# EAGLE design kick_test (EAGLE 4.16)
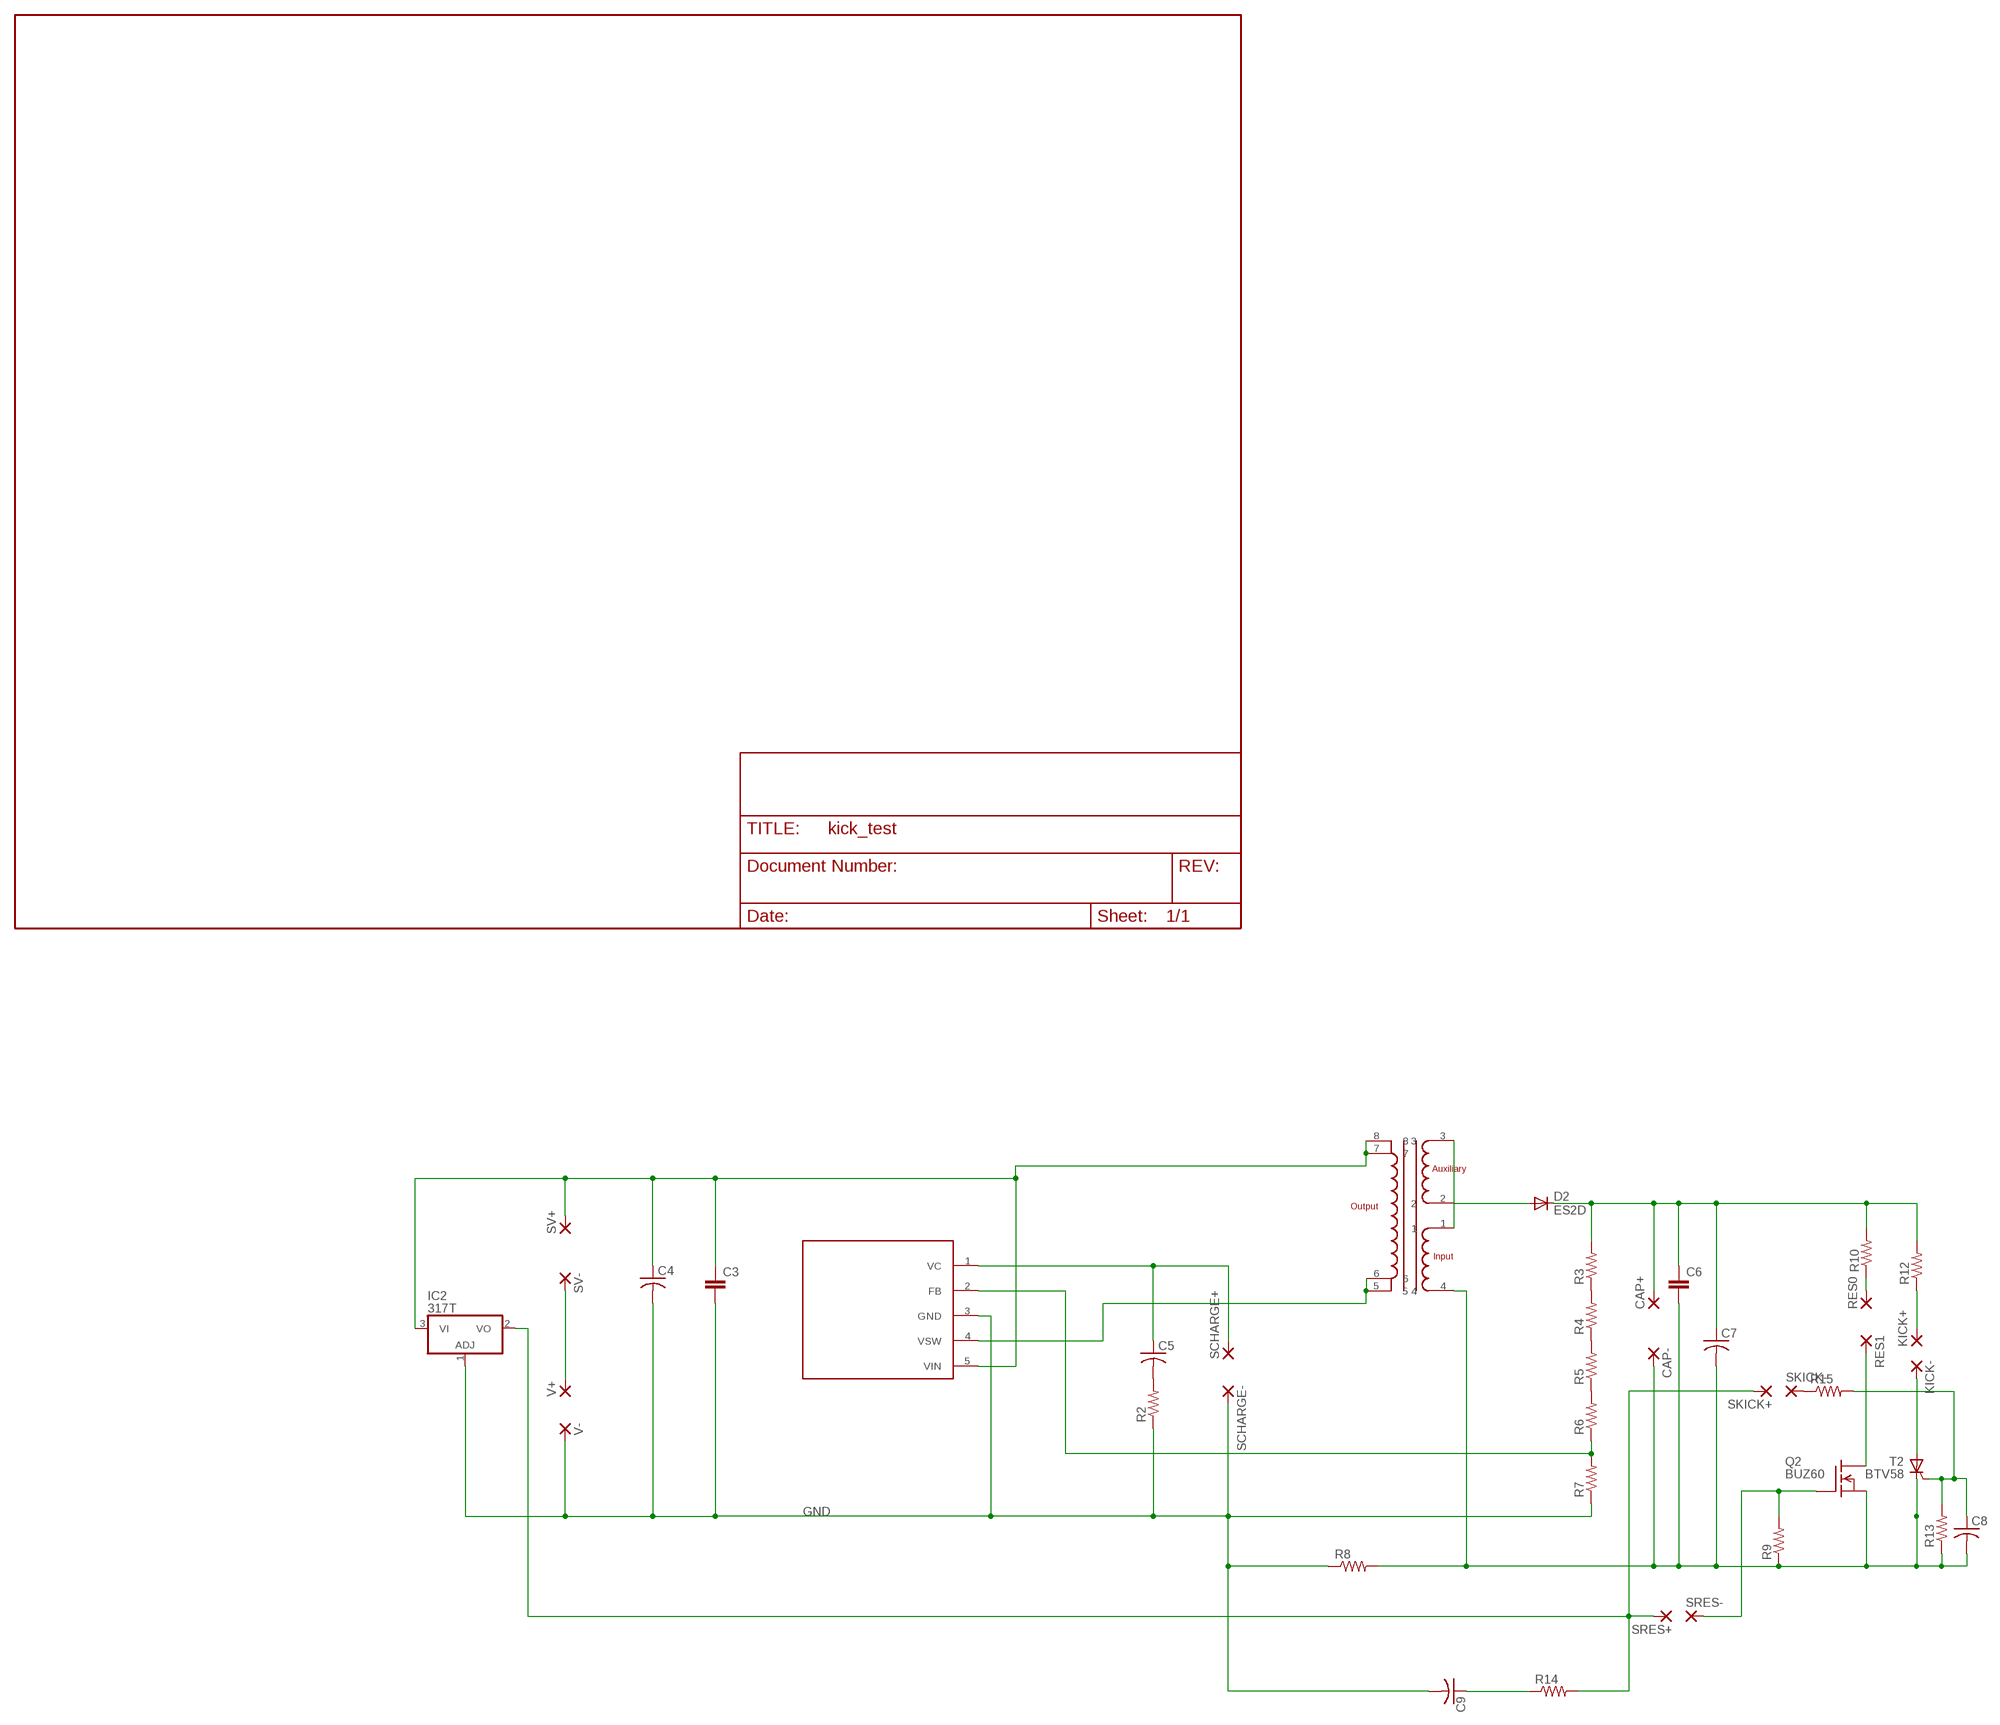
[diagram p0: schematic, sheet 1]

## Parts
C3  C-EU025-050X050  [C025-050X050]
C4  C-USC0805  [C0805]
C5  C-USC0805  [C0805]
C6  C-EU025-050X050  [C025-050X050]
C7  C-USC0805  [C0805]
C8  C-USC0805  [C0805]
C9  C-USC0805  [C0805]
CAP+  3,81/1,4  [3,81/1,4]
CAP-  3,81/1,4  [3,81/1,4]
D2  ES2D  [SMB]
IC2  317T  [TO220H]
KICK+  3,81/1,4  [3,81/1,4]
KICK-  3,81/1,4  [3,81/1,4]
Q2  BUZ60  [TO220]
R2  R-US_R0805  [R0805]
R3  R-US_R0805  [R0805]
R4  R-US_R0805  [R0805]
R5  R-US_R0805  [R0805]
R6  R-US_R0805  [R0805]
R7  R-US_R0805  [R0805]
R8  R-US_R0805  [R0805]
R9  R-US_R0805  [R0805]
R10  R-US_R0805  [R0805]
R12  R-US_R0805  [R0805]
R13  R-US_R0805  [R0805]
R14  R-US_R0805  [R0805]
R15  R-US_R0805  [R0805]
RES0  3,81/1,4  [3,81/1,4]
RES1  3,81/1,4  [3,81/1,4]
SCHARGE+  3,81/1,4  [3,81/1,4]
SCHARGE-  3,81/1,4  [3,81/1,4]
SKICK+  3,81/1,4  [3,81/1,4]
SKICK-  3,81/1,4  [3,81/1,4]
SRES+  3,81/1,4  [3,81/1,4]
SRES-  3,81/1,4  [3,81/1,4]
SV+  3,81/1,4  [3,81/1,4]
SV-  3,81/1,4  [3,81/1,4]
T2  BTV58  [TO220CS]
U$1  LT1070  [TO220-5]
U$2  A0009-AL  [SM]
V+  3,81/1,4  [3,81/1,4]
V-  3,81/1,4  [3,81/1,4]

## Nets
GND: C3.2 C4.2 C9.2 IC2.1(ADJ) R2.1 R7.1 R8.1 SCHARGE-.1(P) U$1.3(GND) V-.1(P)
N$1: SV-.1(P) V+.1(P)
N$2: KICK+.1(P) R12.1
N$3: U$1.4(VSW) U$2.5 U$2.6
N$4: C5.1 SCHARGE+.1(P) U$1.1(VC)
N$5: C3.1 C4.1 IC2.3(VI) SV+.1(P) U$1.5(VIN) U$2.7 U$2.8
N$6: R6.1 R7.2 U$1.2(FB)
N$7: D2.A U$2.2
N$9: C5.2 R2.2
N$10: C6.2 C7.2 C8.2 CAP-.1(P) Q2.3(S) R8.2 R9.1 R13.1 T2.C U$2.4
N$11: C6.1 C7.1 CAP+.1(P) D2.C R3.2 R10.2 R12.2
N$12: R3.1 R4.2
N$13: R4.1 R5.2
N$14: R5.1 R6.2
N$15: U$2.1 U$2.3
N$16: R10.1 RES0.1(P)
N$18: Q2.2(D) RES1.1(P)
N$19: IC2.2(VO) R14.2 SKICK+.1(P) SRES+.1(P)
N$20: KICK-.1(P) T2.A
N$21: C8.1 R13.2 R15.2 T2.G
N$22: R15.1 SKICK-.1(P)
N$23: C9.1 R14.1
N$24: Q2.1(G) R9.2 SRES-.1(P)

## Library data of the parts
C3 C6 = rcl:C-EU: CAPACITOR, European symbol
C4 C5 C7-C9 = rcl:C-US: CAPACITOR, American symbol
CAP+ CAP- KICK+ KICK- RES0 RES1 SCHARGE+ SCHARGE- SKICK+ SKICK- SRES+ SRES- SV+ SV- V+ V- = wirepad:3,81/1,4: THROUGH-HOLE PAD
D2 = diode:ES2D: DIODE super fast rectifier, 2 A
IC2 = linear:*317: Positive VOLTAGE REGULATOR
Q2 = transistor-fet:BUZ60: N-Channel Enhancement MOSFET 400V; 5,5A; 1,0Ohm
R2-R10 R12-R15 = rcl:R-US_: RESISTOR, American symbol
T2 = triac:BTV58: THYRISTOR
U$1 = linear-technology:LT1070
U$2 = Kicker2:A0009-AL

## Board
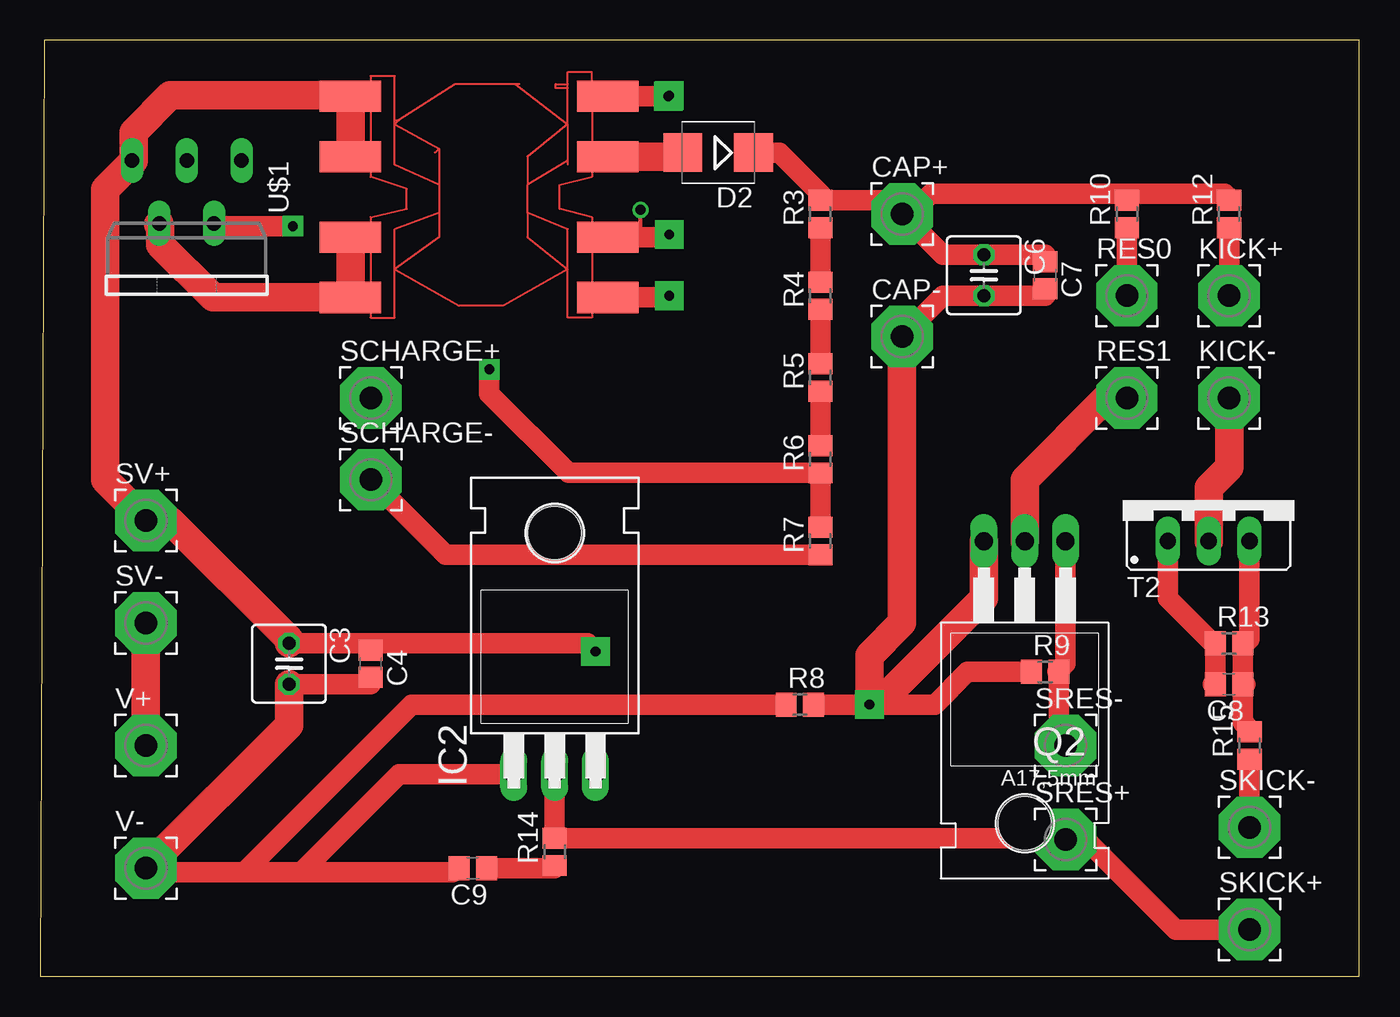
[diagram p1: board, top side]
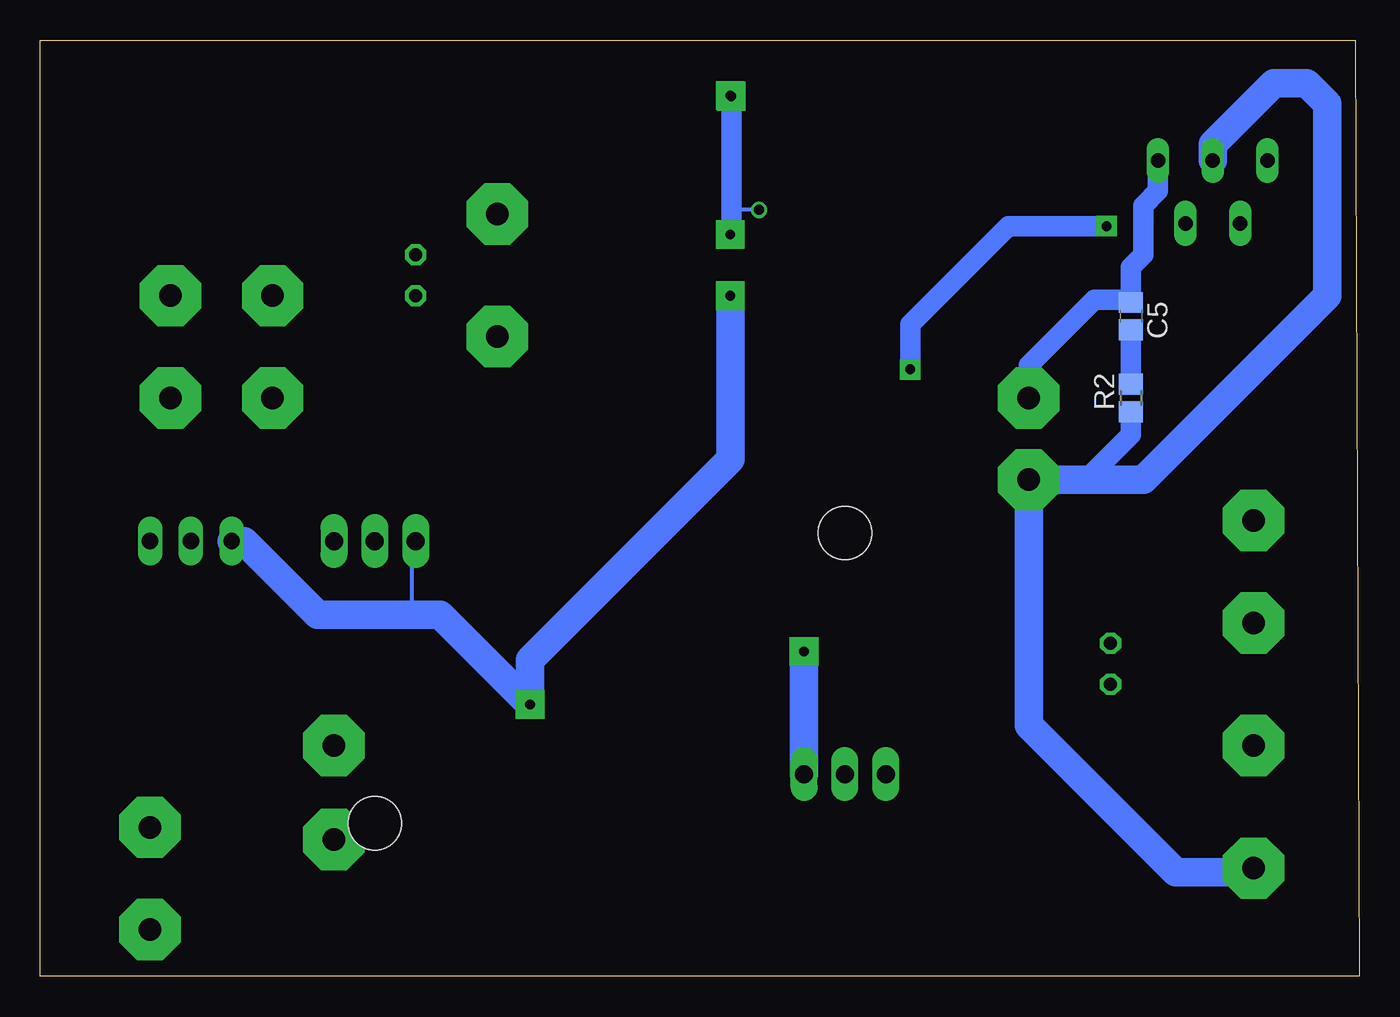
[diagram p2: board, bottom side, seen from below]

Size 81.97 x 58.16 mm. Coordinates in mm from the lower left corner, seen from the top.
Outline: 0,0 81.97,0 81.97,58.16 0.25,58.16 0,0
Copper layers (1*16): Top 0.035mm / dielectric 1.5mm / Bottom 0.035mm
Design rules "default": minimum track width 10mil, minimum drill 24mil, track to track 8mil, track to pad 8mil, pad to pad 8mil, via to via 8mil, smd to smd 8mil, copper to edge 40mil, drill to drill 8mil, minimum pad ring 10mil, minimum via ring 8mil, stop-mask expansion 4mil, vias tented up to drill 0mil, thermal gap 10mil

### Footprints (pad centres in the part's own frame; a part is rotated, then mirrored left to right if it is on the bottom)
C025-050X050 = drill 0.813 octagon: 1 -1.27,0; 2 1.27,0
C0805 = smd 1.3 x 1.5: 1 -0.85,0; 2 0.85,0
3,81/1,4 = drill 1.397 pad 3.81 octagon: 1 0,0
SMB = smd 2.4 x 2.4: A 2.2,0; C -2.2,0
TO220H = drill 1.118 long: 1 -2.54,-10.16; 2 0,-10.16; 3 2.54,-10.16 | hole 3.302: 0,4.826
TO220 = drill 1.118 long: 1 -2.54,-6.35; 2 0,-6.35; 3 2.54,-6.35 | hole 3.302: 0,11.176
R0805 = smd 1.3 x 1.5: 1 -0.85,0; 2 0.85,0
TO220CS = drill 1.016 long: A 0,-2.54; C -2.54,-2.54; G 2.54,-2.54
TO220-5 = drill 0.9 long: 1 -3.4,-8.4; 2 -1.7,-4.5; 3 0,-8.4; 4 1.7,-4.5; 5 3.4,-8.4
SM = smd 3.81 x 1.93: 1 0.5,-3.5; 2 0.5,0.25; 3 0.5,5.25; 4 0.5,9; 5 16.5,9; 6 16.5,5.25; 7 16.5,0.25; 8 16.5,-3.5

### Placement (x,y rotation side)
C3  15.46,19.43 270 top
C4  20.54,19.43 270 top
C5  14.19,41.02 270 bottom
C6  58.64,43.56 270 top
C7  62.45,43.56 270 top
C8  73.88,18.16 180 top
C9  26.89,6.73 180 top
CAP+  53.56,47.37 0 top
CAP-  53.56,39.75 0 top
D2  42.13,51.18 180 top
IC2  31.97,22.73 0 top
KICK+  73.88,42.29 0 top
KICK-  73.88,35.94 0 top
Q2  61.18,20.7 180 top
R2  14.19,35.94 90 bottom
R3  48.48,47.37 90 top
R4  48.48,42.29 90 top
R5  48.48,37.21 90 top
R6  48.48,32.13 90 top
R7  48.48,27.05 90 top
R8  47.21,16.89 0 top
R9  62.45,18.92 0 top
R10  67.53,47.37 90 top
R12  73.88,47.37 90 top
R13  73.88,20.7 0 top
R14  31.97,7.74 90 top
R15  75.15,14.35 90 top
RES0  67.53,42.29 0 top
RES1  67.53,35.94 0 top
SCHARGE+  20.54,35.94 0 top
SCHARGE-  20.54,30.86 0 top
SKICK+  75.15,2.92 0 top
SKICK-  75.15,9.27 0 top
SRES+  63.72,8.5 0 top
SRES-  63.72,14.35 0 top
SV+  6.57,28.32 0 top
SV-  6.57,21.97 0 top
T2  72.61,29.59 0 top
U$1  9.11,42.29 180 top
U$2  35.78,51.18 180 top
V+  6.57,14.35 0 top
V-  6.57,6.73 0 top

### Tracks (layer width: path | path; a pad name or v marks a point on that pad's centre or on a via)
GND
  Top 1.27: C4.2 20.54,18.16 C3.2 | R8.1 23.08,16.89 12.66,6.47 12.15,6.47 | V-.1 6.31,6.73 6.57,6.47 12.15,6.47 | IC2.1 22.31,12.57 16.22,6.47 14.95,6.47 | 12.15,6.47 14.95,6.47 | C9.2 25.87,6.73 25.62,6.47 14.95,6.47 | R7.1 25.2,26.2 SCHARGE-.1
  Top 1.778: C3.2 15.46,15.62 V-.1
  Bottom 1.27: 16.73,30.86 16.73,31.11 14.19,33.65 R2.1
  Bottom 1.778: U$1.3 9.11,51.68 5.3,55.49 3.26,55.49 1.99,54.22 1.99,42.29 13.42,30.86 16.73,30.86 SCHARGE-.1 20.54,15.62 11.39,6.47 6.82,6.47 V-.1
N$1
  Top 1.778: V+.1 SV-.1
N$2
  Top 1.27: KICK+.1 R12.1
N$3
  Top 1.778: U$2.6 19.28,42.3 19.27,42.29 19.28,42.28 U$2.5 10.74,42.18 7.46,45.46 7.46,46.6 7.33,46.73 7.38,46.79 U$1.4
N$4
  Bottom 1.27: U$1.1 12.51,48.79 13.42,47.87 13.42,44.83 14.19,44.06 14.19,42.03 | SCHARGE+.1 20.54,37.97 16.47,42.03 14.19,42.03 | 14.19,42.03 C5.1
N$5  (via drill 0.6 pad 1.78)
  Top 1.27: C3.1 20.54,20.7 | v34.51,20.19 34,20.7 20.54,20.7 | 20.54,20.7 C4.1
  Top 1.778: U$2.8 19.28,54.62 19.27,54.61 19.28,54.6 U$2.7 19.28,54.72 19.27,54.73 8.09,54.73 5.8,52.45 5.8,50.67 5.79,50.69 U$1.5 5.71,50.57 4.03,48.89 4.03,30.86 SV+.1 8.09,28.32 15.46,20.95 C3.1
  Bottom 1.778: SV+.1 6.82,28.32 | IC2.3 v34.51,20.19
N$6  (via drill 0.6 pad 1.27)
  Top 1.27: R7.2 R6.1 32.82,31.28 27.9,36.19 v27.9,37.71 | U$1.2 10.81,46.68 10.88,46.6 v15.71,46.6
  Bottom 1.27: v27.9,37.71 27.9,40.51 21.81,46.6 v15.71,46.6
N$7
  Top 1.778: 40.09,50.93 39.93,51.09 D2.A | U$2.2 40.09,50.93 | 40.09,50.93 40.09,50.92
N$8  (via drill 0.6 pad 1.78)
  other vias: 51.52,16.89
N$9
  Bottom 1.27: R2.2 C5.2
N$10  (via drill 0.6 pad 1.78)
  Top 1.27: CAP-.1 56.1,42.29 C6.2 62.45,42.29 C7.2 | U$2.4 38.97,42.18 v39.08,42.29 | R9.1 57.62,18.92 55.59,16.89 51.52,16.89 R8.2 | T2.C 70.07,23.49 72.86,20.7 R13.1 73.03,18.32 72.86,18.16 C8.2
  Top 1.778: CAP-.1 53.56,21.97 51.52,19.93 51.52,16.89 51.78,17.14 52.29,17.14 58.64,23.49 Q2.3
  Bottom 0.254: Q2.3 58.89,26.03 58.89,22.47 58.89,22.22
  Bottom 1.778: v39.08,42.29 39.08,32.13 51.52,19.68 51.52,16.89 57.11,22.47 58.89,22.47 64.73,22.47 69.3,27.05 T2.C
N$11
  Top 1.27: CAP+.1 54.06,47.37 55.33,48.64 67.53,48.64 | R12.2 73.88,48.38 73.62,48.64 67.53,48.64 | 67.53,48.64 R10.2 | CAP+.1 56.1,44.83 C6.1 62.45,44.83 C7.1 | D2.C 45.94,51.18 48.48,48.64 R3.2 52.71,48.22 CAP+.1
N$12
  Top 1.27: R4.2 R3.1
N$13
  Top 1.27: R5.2 R4.1
N$14
  Top 1.27: R6.2 R5.1
N$15  (via drill 0.6 pad 1.78, 0.61)
  Top 0.254: 37.3,45.93 v37.3,47.62
  Top 1.27: U$2.1 v39.02,54.68 39.08,54.73 | U$2.3 37.3,45.93 38.91,45.93 39.08,46.1
  Bottom 0.254: v37.3,47.62 39.02,47.62
  Bottom 1.27: v39.02,54.68 39.02,47.62 39.02,46.15 39.08,46.1
N$16
  Top 1.27: RES0.1 R10.1
N$17  (via drill 0.6 pad 1.78)
  other vias: 39.08,46.1
N$18
  Top 1.778: RES1.1 66.26,35.94 61.18,30.86 Q2.2
N$19
  Top 1.27: IC2.2 R14.2 63.37,8.59 63.72,8.25 | 63.72,8.25 SRES+.1 | 63.72,8.25 65.24,8.25 70.57,2.92 74.89,2.92 75.15,2.66 SKICK+.1
N$20
  Top 1.778: KICK-.1 73.88,31.62 72.61,30.35 T2.A
N$21
  Top 1.27: T2.G 75.15,20.95 74.89,20.7 R13.2 74.73,18.32 74.89,18.16 C8.1 74.73,15.78 75.15,15.36 R15.2
N$22
  Top 1.27: SKICK-.1 R15.1
N$23
  Top 1.27: R14.1 31.97,6.73 C9.1
N$24
  Top 1.27: Q2.1 63.72,19.43 63.21,18.92 R9.2 63.3,14.77 SRES-.1
N$25  (via drill 0.6 pad 1.78)
  other vias: 39.08,54.73
N$26  (via drill 0.6 pad 1.78)
  other vias: 39.08,42.29
N$27  (via drill 0.6 pad 1.27)
  other vias: 27.9,37.71
N$28  (via drill 0.6 pad 1.27)
  other vias: 15.71,46.6
N$29  (via drill 0.6 pad 1.78)
  other vias: 34.51,20.19